# EAGLE design xplduino_v0_0_final_4 (EAGLE 5.10)
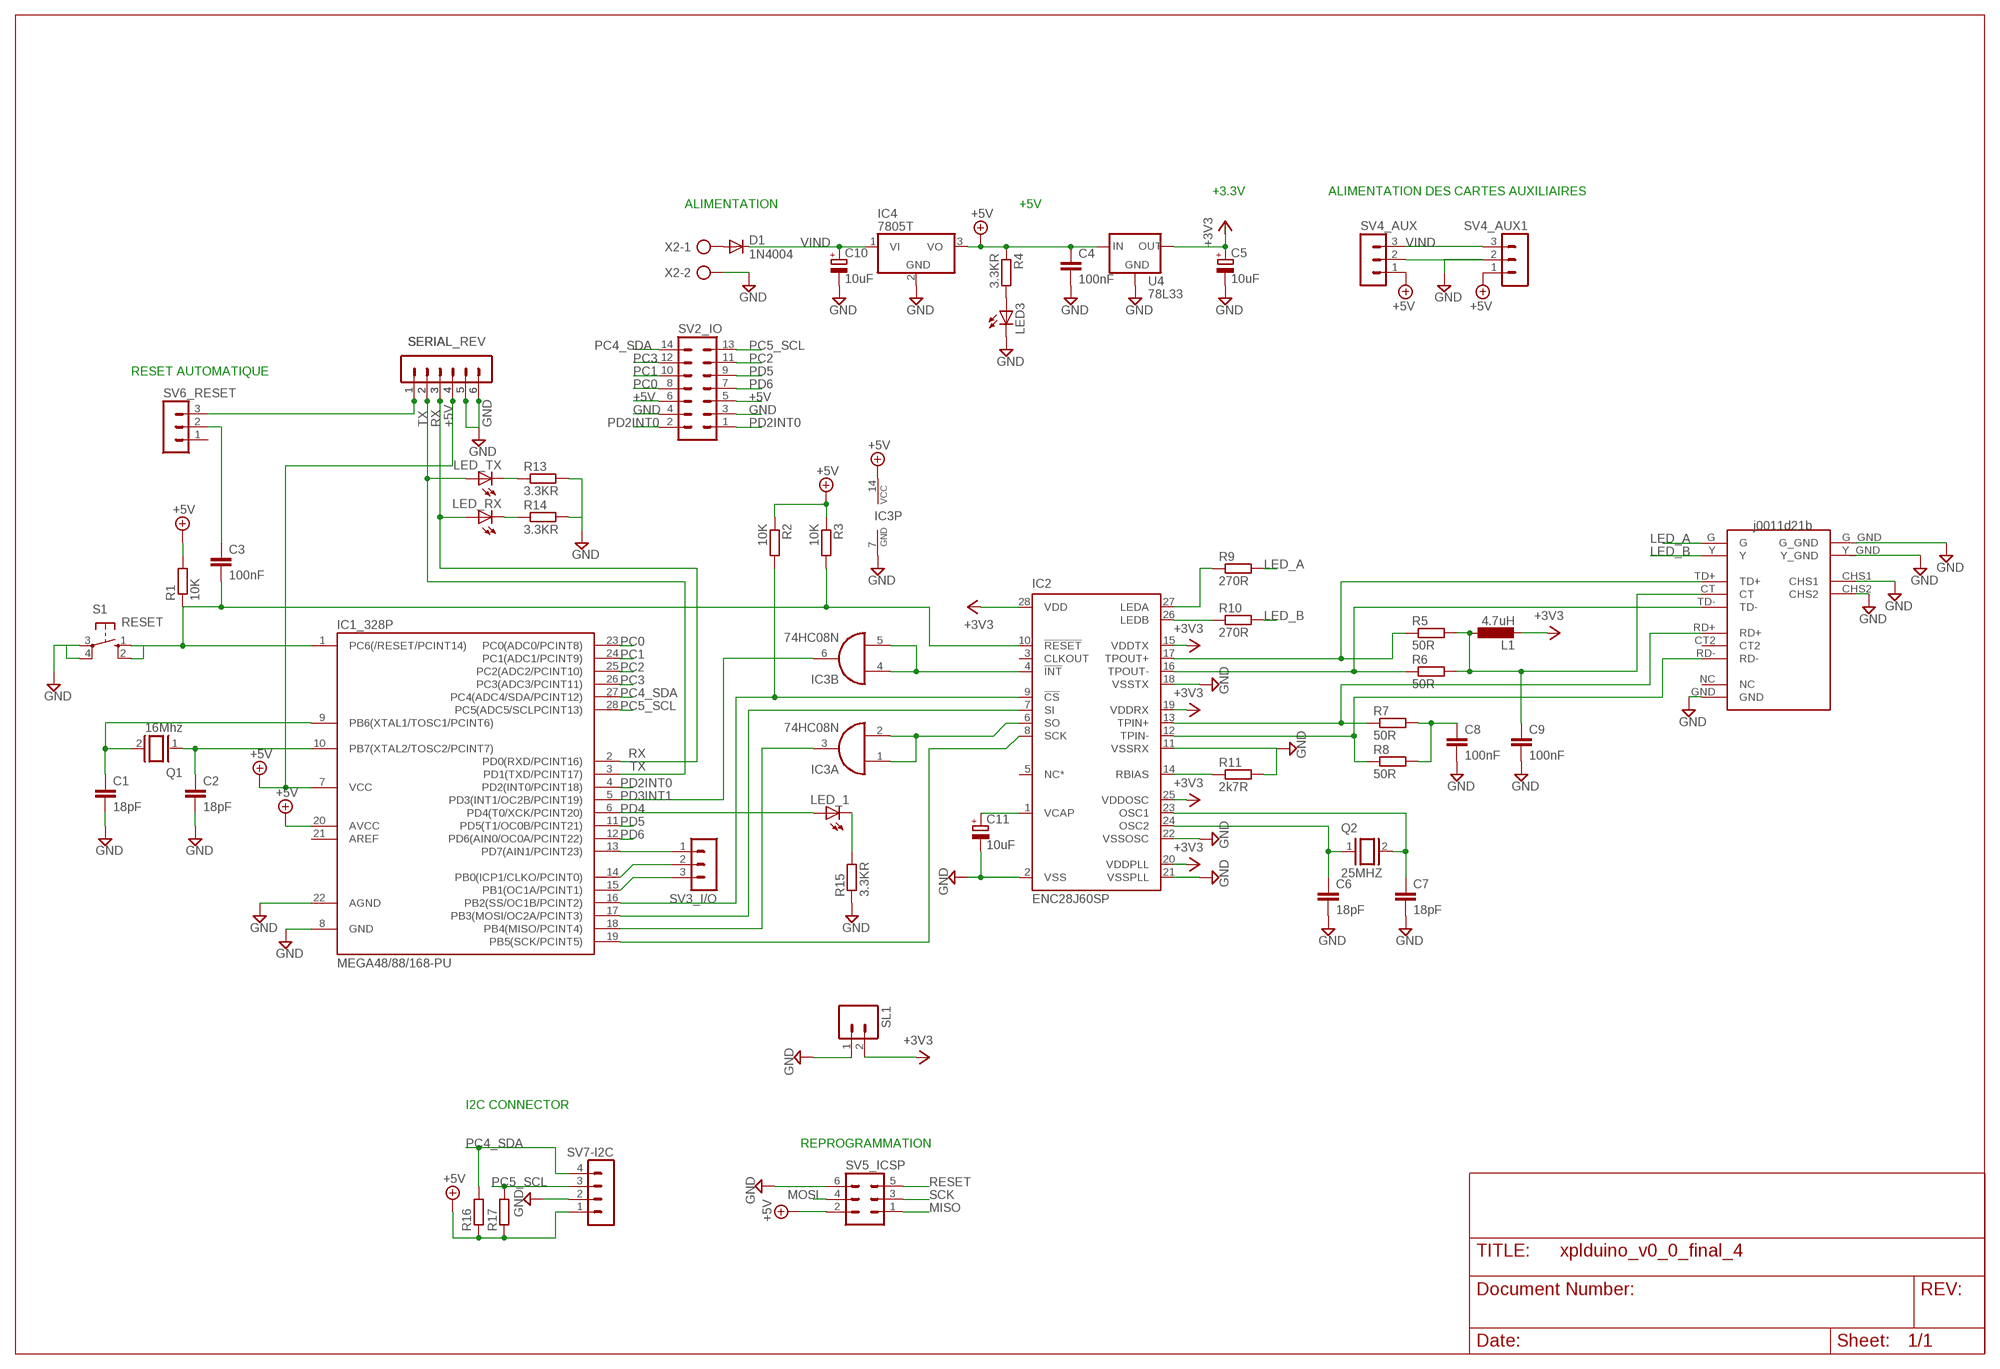
[diagram p0: schematic, sheet 1]

## Parts
C1  18pF  C-EU025-025X050  [C025-025X050]
C2  18pF  C-EU025-025X050  [C025-025X050]
C3  100nF  C-EU025-025X050  [C025-025X050]
C4  100nF  C-EU025-025X050  [C025-025X050]
C5  10uF  CPOL-EUE2-5  [E2-5]
C6  18pF  C-EU025-025X050  [C025-025X050]
C7  18pF  C-EU025-025X050  [C025-025X050]
C8  100nF  C-EU025-025X050  [C025-025X050]
C9  100nF  C-EU025-025X050  [C025-025X050]
C10  10uF  CPOL-EUE2-5  [E2-5]
C11  10uF  CPOL-EUE2-5  [E2-5]
D1  1N4004  DIODE-D-5  [D-5]
IC1_328P  MEGA48/88/168-PU  [DIL28-3]
IC2  ENC28J60SP  [DIL28-3]
IC3  74HC08N  [DIL14]
IC4  7805T  [TO220H]
L1  4.7uH  L-EU0207/7  [0207/7]
LED3  LED3MM  [LED3MM]
LED_1  LED3MM  [LED3MM]
LED_RX  LED3MM  [LED3MM]
LED_TX  LED3MM  [LED3MM]
Q1  16Mhz  XTAL/S  [QS]
Q2  25MHZ  XTAL/S  [QS]
R1  10K  R-EU_0207/7  [0207/7]
R2  10K  R-EU_0207/7  [0207/7]
R3  10K  R-EU_0207/7  [0207/7]
R4  3.3KR  R-EU_0207/7  [0207/7]
R5  50R  R-EU_0207/7  [0207/7]
R6  50R  R-EU_0207/7  [0207/7]
R7  50R  R-EU_0207/7  [0207/7]
R8  50R  R-EU_0207/7  [0207/7]
R9  270R  R-EU_0207/7  [0207/7]
R10  270R  R-EU_0207/7  [0207/7]
R11  2k7R  R-EU_0207/7  [0207/7]
R13  3.3KR  R-EU_0207/7  [0207/7]
R14  3.3KR  R-EU_0207/7  [0207/7]
R15  3.3KR  R-EU_0207/7  [0207/7]
R16  R-EU_0204/5  [0204/5]
R17  R-EU_0204/5  [0204/5]
S1  RESET  10-XX  [B3F-10XX]
SERIAL  MA06-1  [MA06-1]
SERIAL_REV  MA06-1  [MA06-1]
SL1  MA02  [02PA]
SV2_IO  MA07-2  [MA07-2]
SV3_I/O  MA03-1  [MA03-1]
SV4_AUX  MA03-1  [MA03-1]
SV4_AUX1  MA03-1  [MA03-1]
SV5_ICSP  MA03-2  [MA03-2]
SV6_RESET  MA03-1  [MA03-1]
SV7-I2C  MA04-1  [MA04-1]
U4  78L33  78LXX  [78LXX]
U$1  J0011D21B  [J0011D21B]
X2  AK500/2-H  [AK500/2-H]

## Nets
+3V3: C5.+ IC2.15(VDDTX) IC2.19(VDDRX) IC2.20(VDDPLL) IC2.25(VDDOSC) IC2.28(VDD) L1.2 SL1.2 U4.OUT
+5V: C4.1 IC1_328P.7(VCC) IC1_328P.20(AVCC) IC3.14(P:VCC) IC4.3(VO) R1.2 R2.1 R3.1 R4.1 R16.1 R17.1 SERIAL.4 SERIAL_REV.4 SV2_IO.5 SV2_IO.6 SV4_AUX1.1 SV4_AUX.1 SV5_ICSP.2 SV7-I2C.1 U4.IN
GND: C1.2 C2.2 C4.2 C5.- C6.2 C7.2 C8.2 C9.2 C10.- C11.- IC1_328P.8(GND) IC1_328P.22(AGND) IC2.2(VSS) IC2.11(VSSRX) IC2.18(VSSTX) IC2.21(VSSPLL) IC2.22(VSSOSC) IC3.7(P:GND) IC4.2(GND) LED3.K(C) R11.2 R13.2 R14.2 R15.1 S1.3(P) S1.4(P1) SERIAL.5 SERIAL.6 SERIAL_REV.5 SERIAL_REV.6 SL1.1 SV2_IO.3 SV2_IO.4 SV4_AUX1.2 SV4_AUX.2 SV5_ICSP.6 SV7-I2C.2 U4.GND U$1.CHS1 U$1.CHS2 U$1.G_GND U$1.GND U$1.Y_GND X2.2
LED_A: R9.2 U$1.G
LED_B: R10.2 U$1.Y
LEDA: IC2.27(LEDA) R9.1
LEDB: IC2.26(LEDB) R10.1
MISO: IC1_328P.18(PB4(MISO/PCINT4)) IC3.3(A:O) SV5_ICSP.1
MOSI: IC1_328P.17(PB3(MOSI/OC2A/PCINT3)) IC2.7(SI) SV5_ICSP.4
N$1: LED_TX.K(C) R13.1
N$2: LED_RX.K(C) R14.1
N$3: IC1_328P.14(PB0(ICP1/CLKO/PCINT0)) SV3_I/O.2
N$4: IC2.4(!INT) IC3.4(B:I0) IC3.5(B:I1)
N$6: IC1_328P.15(PB1(OC1A/PCINT1)) SV3_I/O.3
N$7: C2.1 IC1_328P.10(PB7(XTAL2/TOSC2/PCINT7)) Q1.1
N$8: C1.1 IC1_328P.9(PB6(XTAL1/TOSC1/PCINT6)) Q1.2
N$9: LED_1.K(C) R15.2
N$10: C3.1 SV6_RESET.2
N$11: IC2.6(SO) IC3.1(A:I0) IC3.2(A:I1)
N$12: IC1_328P.13(PD7(AIN1/PCINT23)) SV3_I/O.1
N$15: LED3.A R4.2
N$17: C11.+ IC2.1(VCAP)
N$18: IC2.14(RBIAS) R11.1
N$19: C6.1 IC2.24(OSC2) Q2.1
N$20: C7.1 IC2.23(OSC1) Q2.2
N$25: C8.1 R7.2 R8.2
N$26: C9.1 L1.1 R5.2 R6.2 U$1.CT
PC0: IC1_328P.23(PC0(ADC0/PCINT8)) SV2_IO.8
PC1: IC1_328P.24(PC1(ADC1/PCINT9)) SV2_IO.10
PC2: IC1_328P.25(PC2(ADC2/PCINT10)) SV2_IO.11
PC3: IC1_328P.26(PC3(ADC3/PCINT11)) SV2_IO.12
PC4_SDA: IC1_328P.27(PC4(ADC4/SDA/PCINT12)) R16.2 SV2_IO.14 SV7-I2C.4
PC5_SCL: IC1_328P.28(PC5(ADC5/SCLPCINT13)) R17.2 SV2_IO.13 SV7-I2C.3
PD2INT0: IC1_328P.4(PD2(INT0/PCINT18)) SV2_IO.1 SV2_IO.2
PD3INT1: IC1_328P.5(PD3(INT1/OC2B/PCINT19)) IC3.6(B:O)
PD4: IC1_328P.6(PD4(T0/XCK/PCINT20)) LED_1.A
PD5: IC1_328P.11(PD5(T1/OC0B/PCINT21)) SV2_IO.9
PD6: IC1_328P.12(PD6(AIN0/OC0A/PCINT22)) SV2_IO.7
RESET: C3.2 IC1_328P.1(PC6(/RESET/PCINT14)) IC2.10(!RESET) R1.1 R3.2 S1.1(S) S1.2(S1) SV5_ICSP.5
RTS: SERIAL.1 SERIAL_REV.1 SV6_RESET.3
RX: IC1_328P.2(PD0(RXD/PCINT16)) LED_RX.A SERIAL.3 SERIAL_REV.3
SCK: IC1_328P.19(PB5(SCK/PCINT5)) IC2.8(SCK) SV5_ICSP.3
SS: IC1_328P.16(PB2(SS/OC1B/PCINT2)) IC2.9(!CS) R2.2
TPIN+: IC2.13(TPIN+) R7.1 U$1.RD+
TPIN-: IC2.12(TPIN-) R8.1 U$1.RD-
TPOUT+: IC2.17(TPOUT+) R5.1 U$1.TD+
TPOUT-: IC2.16(TPOUT-) R6.1 U$1.TD-
TX: IC1_328P.3(PD1(TXD/PCINT17)) LED_TX.A SERIAL.2 SERIAL_REV.2
VIN: D1.A X2.1
VIND: C10.+ D1.C IC4.1(VI) SV4_AUX1.3 SV4_AUX.3
Unconnected: IC1_328P.21(AREF) IC2.3(CLKOUT) IC2.5(NC*) IC3.8(C:O) IC3.9(C:I0) IC3.10(C:I1) IC3.11(D:O) IC3.12(D:I0) IC3.13(D:I1) SV6_RESET.1 U$1.CT2 U$1.NC

## Notes on the sheet
- +3.3V | ALIMENTATION DES CARTES AUXILIAIRES
- ALIMENTATION | +5V
- RESET AUTOMATIQUE
- I2C CONNECTOR
- REPROGRAMMATION

## Library data of the parts
C1-C4 C6-C9 = resistor:C-EU: CAPACITOR, European symbol
C5 C10 C11 = rcl:CPOL-EU: POLARIZED CAPACITOR, European symbol
D1 = diode:DIODE-: DIODE
IC1_328P = avr-7:MEGA48/88/168-PU
IC2 = microchip:ENC28J60: Stand-Alone Ethernet Controller with SPI Interface Source: http://ww1.microchip.com/downloads/en/DeviceDoc/39662c.pdf
IC3 = 74xx-eu:74*08: Quad 2-input AND gate
IC4 = linear:78*: Positive VOLTAGE REGULATOR Source: http://cache.national.com/ds/LM/LM78L05.pdf http://www.fairchildsemi.com/ds/LM/LM7805.pdf
L1 = rcl:L-EU: INDUCTOR, European symbol
LED3 LED_1 LED_RX LED_TX = led:LED: LED OSRAM: - CHIPLED LG R971, LG N971, LY N971, LG Q971, LY Q971, LO R971, LY R971 LH N974, LH R974 LS Q976, LO Q976, LY Q976 LO Q996 - Hyper CHIPLED LW Q18S LB Q993, LB Q99A, LB R99A - SideLED LS A670, LO A670, LY A670, LG A670, LP A670 LB A673, LV A673, LT A673, LW A673 LH A674 LY A675 LS A676, LA A676, LO A676, LY A676, LW A676 LS A679, LY A679, LG A679 - Hyper Micro SIDELED® LS Y876, LA Y876, LO Y876, LY Y876 LT Y87S - SmartLED LW L88C, LW L88S LB L89C, LB L89S, LG L890 LS L89K, LO L89K, LY L89K LS L896, LA L896, LO L896, LY L896 - TOPLED LS T670, LO T670, LY T670, LG T670, LP T670 LSG T670, LSP T670, LSY T670, LOP T670, LYG T670 LG T671, LOG T671, LSG T671 LB T673, LV T673, LT T673, LW T673 LH T674 LS T676, LA T676, LO T676, LY T676, LB T676, LH T676, LSB T676, LW T676 LB T67C, LV T67C, LT T67C, LS T67K, LO T67K, LY T67K, LW E67C LS E67B, LA E67B, LO E67B, LY E67B, LB E67C, LV E67C, LT E67C LW T67C LS T679, LY T679, LG T679 LS T770, LO T770, LY T770, LG T770, LP T770 LB T773, LV T773, LT T773, LW T773 LH T774 LS E675, LA E675, LY E675, LS T675 LS T776, LA T776, LO T776, LY T776, LB T776 LHGB T686 LT T68C, LB T68C - Hyper Mini TOPLED® LB M676 - Mini TOPLED Santana® LG M470 LS M47K, LO M47K, LY M47K Source: http://www.osram.convergy.de LUXEON: - LUMILED® LXK2-PW12-R00, LXK2-PW12-S00, LXK2-PW14-U00, LXK2-PW14-V00 LXK2-PM12-R00, LXK2-PM12-S00, LXK2-PM14-U00 LXK2-PE12-Q00, LXK2-PE12-R00, LXK2-PE12-S00, LXK2-PE14-T00, LXK2-PE14-U00 LXK2-PB12-K00, LXK2-PB12-L00, LXK2-PB12-M00, LXK2-PB14-N00, LXK2-PB14-P00, LXK2-PB14-Q00 LXK2-PR12-L00, LXK2-PR12-M00, LXK2-PR14-Q00, LXK2-PR14-R00 LXK2-PD12-Q00, LXK2-PD12-R00, LXK2-PD12-S00 LXK2-PH12-R00, LXK2-PH12-S00 LXK2-PL12-P00, LXK2-PL12-Q00, LXK2-PL12-R00 Source: www.luxeon.com KINGBRIGHT: KA-3528ASYC Source: www.kingbright.com
Q1 Q2 = special:XTAL/S: CRYSTAL
R1-R11 R13-R17 = resistor:R-EU_: RESISTOR, European symbol
S1 = switch-omron:10-XX: OMRON SWITCH
SERIAL SERIAL_REV = con-lstb:MA06-1: PIN HEADER
SL1 = con-amp-quick:MA02: AMP QUICK CONNECTOR; OC_FARNELL: unknown; OC_NEWARK: unknown
SV2_IO = con-lstb:MA07-2: PIN HEADER
SV3_I/O SV4_AUX SV4_AUX1 SV6_RESET = con-lstb:MA03-1: PIN HEADER; OC_FARNELL: unknown; OC_NEWARK: unknown
SV5_ICSP = con-lstb:MA03-2: PIN HEADER; OC_FARNELL: unknown; OC_NEWARK: unknown
SV7-I2C = con-lstb:MA04-1: PIN HEADER; OC_FARNELL: unknown; OC_NEWARK: unknown
U4 = v-reg:78LXX: VOLTAGE REGULATOR
U$1 = con-j0011d21b:J0011D21B
X2 = con-ptr500:AK500/2-H: CONNECTOR Aug. 2004 / PTR Meßtechnik: Die Bezeichnung der Serie AK505 wurde geändert. Es handelt sich hierbei um AK500 in horizontaler Ausführung.

## Board
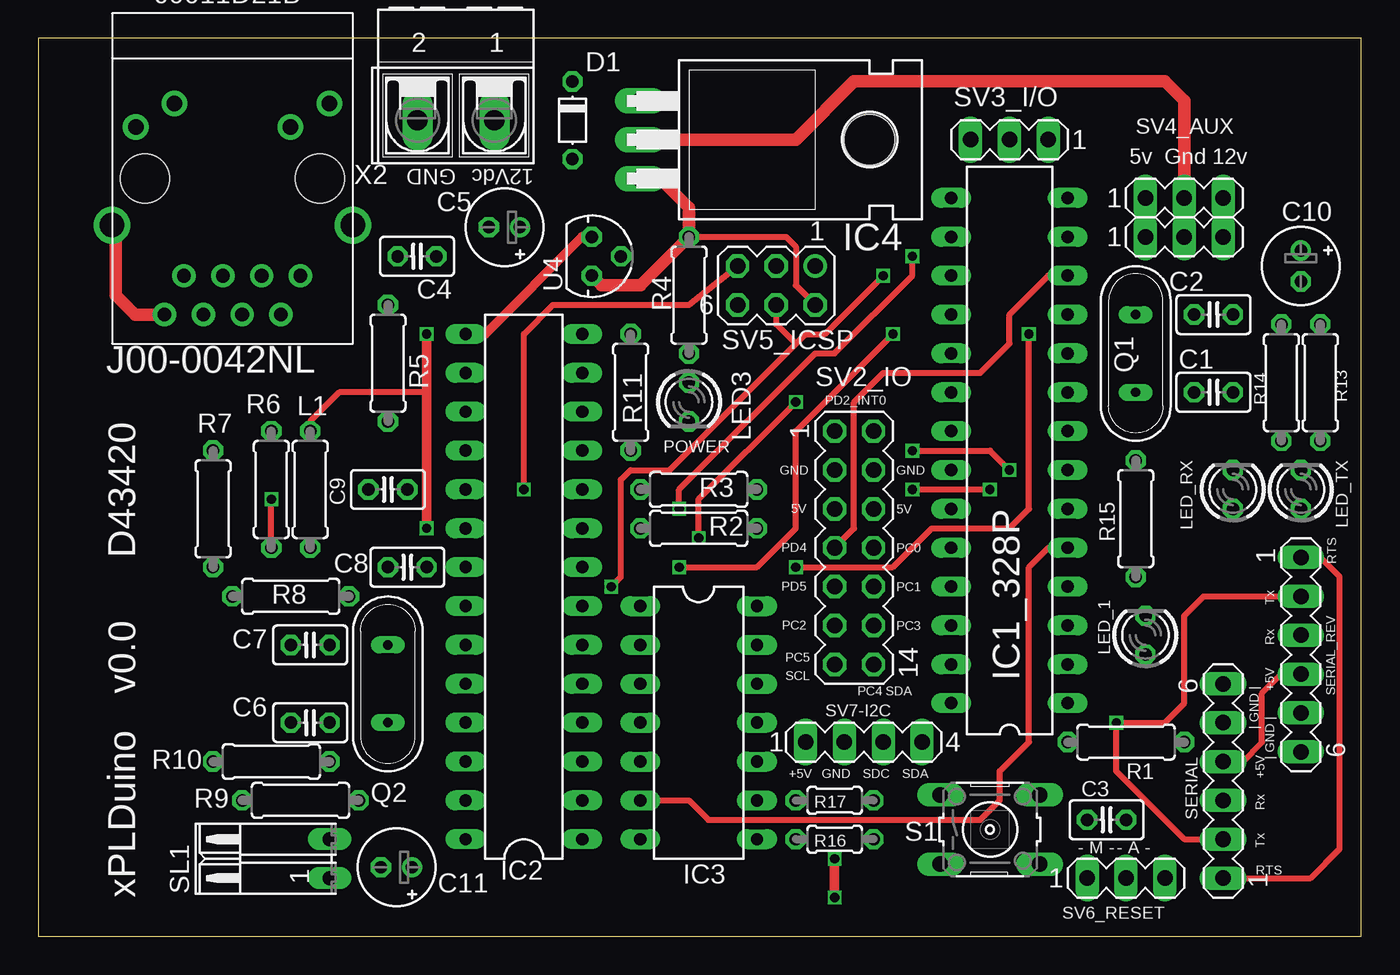
[diagram p1: board, top side]
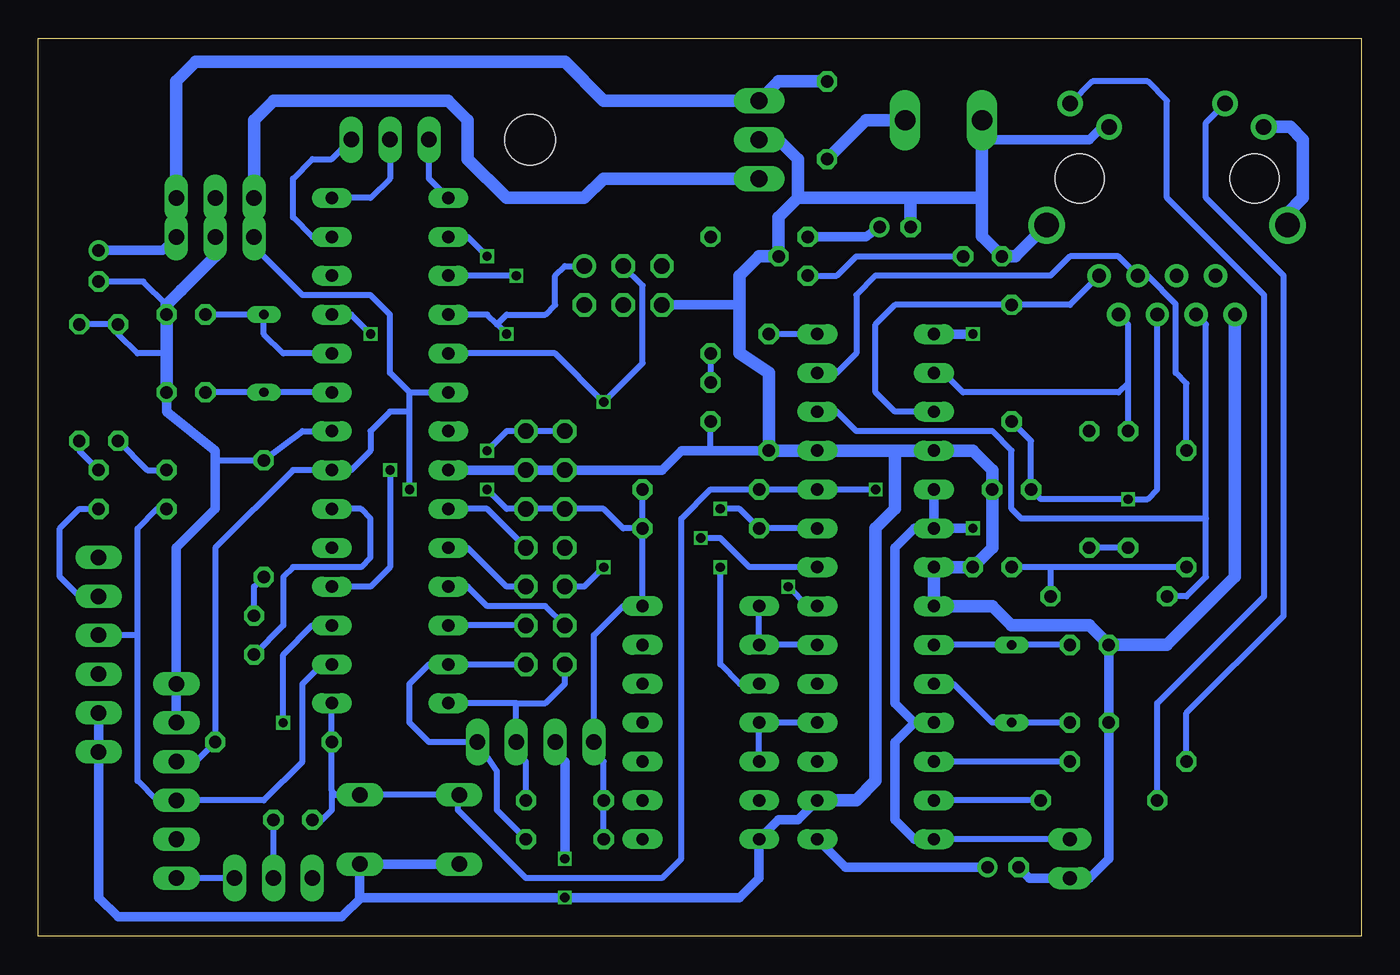
[diagram p2: board, bottom side, seen from below]

Size 86.5 x 58.7 mm. Coordinates in mm from the lower left corner, seen from the top.
Outline: 0,0 86.5,0 86.5,58.7 0,58.7 0,0
Copper layers (1*16): Top 0.035mm / dielectric 1.5mm / Bottom 0.035mm
Design rules "Fusion_eagle_rule_v1.1": minimum track width 6mil, minimum drill 12mil, track to track 6mil, track to pad 6mil, pad to pad 6mil, via to via 6mil, smd to smd 0mil, copper to edge 10mil, drill to drill 10mil, minimum pad ring 10mil, minimum via ring 6mil, stop-mask expansion 2mil, vias tented up to drill 100mil, thermal gap 10mil

### Footprints (pad centres in the part's own frame; a part is rotated, then mirrored left to right if it is on the bottom)
C025-025X050 = drill 0.813 octagon: 1 -1.27,0; 2 1.27,0
E2-5 = drill 0.813 pad 1.27 round: + -1.016,0 | drill 0.813 pad 1.27 octagon: - 1.016,0
D-5 = drill 0.813 octagon: A 2.54,0; C -2.54,0
DIL28-3 = drill 0.813 long: 1 -16.51,-3.81; 2 -13.97,-3.81; 3 -11.43,-3.81; 4 -8.89,-3.81; 5 -6.35,-3.81; 6 -3.81,-3.81; 7 -1.27,-3.81; 8 1.27,-3.81; 9 3.81,-3.81; 10 6.35,-3.81; 11 8.89,-3.81; 12 11.43,-3.81; 13 13.97,-3.81; 14 16.51,-3.81; 15 16.51,3.81; 16 13.97,3.81; 17 11.43,3.81; 18 8.89,3.81; 19 6.35,3.81; 20 3.81,3.81; 21 1.27,3.81; 22 -1.27,3.81; 23 -3.81,3.81; 24 -6.35,3.81; 25 -8.89,3.81; 26 -11.43,3.81; 27 -13.97,3.81; 28 -16.51,3.81
DIL14 = drill 0.813 long: 1 -7.62,-3.81; 2 -5.08,-3.81; 3 -2.54,-3.81; 4 0,-3.81; 5 2.54,-3.81; 6 5.08,-3.81; 7 7.62,-3.81; 8 7.62,3.81; 9 5.08,3.81; 10 2.54,3.81; 11 0,3.81; 12 -2.54,3.81; 13 -5.08,3.81; 14 -7.62,3.81
TO220H = drill 1.118 long: 1 -2.54,-10.16; 2 0,-10.16; 3 2.54,-10.16 | hole 3.302: 0,4.826
0207/7 = drill 0.813 octagon: 1 -3.81,0; 2 3.81,0
LED3MM = drill 0.813 octagon: A -1.27,0; K 1.27,0
QS = drill 0.61 long: 1 -2.54,0; 2 2.54,0
0204/5 = drill 0.813 octagon: 1 -2.54,0; 2 2.54,0
B3F-10XX = drill 1.016 long: 1 -3.251,2.261; 2 3.251,2.261; 3 -3.251,-2.261; 4 3.251,-2.261
MA06-1 = drill 1.016 long: 1 -6.35,0; 2 -3.81,0; 3 -1.27,0; 4 1.27,0; 5 3.81,0; 6 6.35,0
02PA = drill 0.914 long: 1 -1.27,0; 2 1.27,0
MA07-2 = drill 1.016 octagon: 1 -7.62,-1.27; 2 -7.62,1.27; 3 -5.08,-1.27; 4 -5.08,1.27; 5 -2.54,-1.27; 6 -2.54,1.27; 7 0,-1.27; 8 0,1.27; 9 2.54,-1.27; 10 2.54,1.27; 11 5.08,-1.27; 12 5.08,1.27; 13 7.62,-1.27; 14 7.62,1.27
MA03-1 = drill 1.016 long: 1 -2.54,0; 2 0,0; 3 2.54,0
MA03-2 = drill 1.016 round: 1 -2.54,-1.27 | drill 1.016 octagon: 2 -2.54,1.27; 3 0,-1.27; 4 0,1.27; 5 2.54,-1.27; 6 2.54,1.27
MA04-1 = drill 1.016 long: 1 -3.81,0; 2 -1.27,0; 3 1.27,0; 4 3.81,0
78LXX = drill 0.813 octagon: GND 0,1.905; IN 1.27,0; OUT -1.27,0
J0011D21B = drill 1.6 round: CHS1 7.874,-3.048; CHS2 -7.874,-3.048 | drill 0.889 pad 1.524 round: CT 0.635,-8.89; CT2 -0.635,-6.35; GND -4.445,-8.89; NC -3.175,-6.35; RD+ 1.905,-6.35; RD- -1.905,-8.89; TD+ 4.445,-6.35; TD- 3.175,-8.89 | drill 1.016 pad 1.676 round: G 6.325,4.902; G_GND 3.785,3.378; Y -3.785,4.902; Y_GND -6.325,3.378 | hole 3.2: -5.715,0; 5.715,0
AK500/2-H = drill 1.321 long: 1 -2.515,0; 2 2.515,0

### Placement (x,y rotation side)
C1  76.83,35.56 0 top
C2  76.83,40.64 0 top
C3  69.85,7.62 180 top
C4  24.77,44.45 180 top
C5  30.48,46.35 180 top
C6  17.78,13.97 180 top
C7  17.78,19.05 180 top
C8  24.13,24.13 0 top
C9  22.86,29.21 0 top
C10  82.55,43.81 270 top
C11  23.42,4.52 180 top
D1  34.92,53.34 270 top
IC1_328P  63.5,31.75 90 top
IC2  31.75,22.86 90 top
IC3  43.18,13.97 270 top
IC4  49.53,52.07 270 top
L1  17.78,29.21 90 top
LED3  42.55,34.92 270 top
LED_1  72.39,19.68 90 top
LED_RX  78.11,29.21 90 top
LED_TX  82.55,29.21 90 top
Q1  71.75,38.1 270 top
Q2  22.86,16.51 90 top
R1  71.12,12.7 0 top
R2  43.18,26.67 180 top
R3  43.18,29.21 180 top
R4  42.55,41.91 270 top
R5  22.86,37.47 270 top
R6  15.24,29.21 270 top
R7  11.43,27.94 270 top
R8  16.51,22.23 0 top
R9  17.14,8.89 180 top
R10  15.24,11.43 180 top
R11  38.73,35.56 270 top
R13  83.82,36.2 90 top
R14  81.28,36.2 90 top
R15  71.75,27.3 270 top
R16  52.07,6.35 0 top
R17  52.07,8.89 0 top
S1  62.23,6.99 0 top
SERIAL  77.47,10.16 90 top
SERIAL_REV  82.55,18.41 270 top
SL1  19.05,5.08 90 top
SV2_IO  53.34,25.4 270 top
SV3_I/O  63.5,52.07 180 top
SV4_AUX  74.93,45.72 0 top
SV4_AUX1  74.93,48.26 0 top
SV5_ICSP  48.26,42.55 180 top
SV6_RESET  71.12,3.81 0 top
SV7-I2C  53.98,12.7 0 top
U4  36.2,44.45 270 top
U$1  12.7,49.53 0 top
X2  27.3,53.34 180 top

### Tracks (layer width: path | path; a pad name or v marks a point on that pad's centre or on a via)
+3V3  (via drill 0.6)
  Top 0.406: L1.2 17.78,33.66 19.68,35.56 25.4,35.56
  Top 0.61: v25.4,26.67 25.4,35.56 v25.4,39.37 | IC2.15 29.21,39.37 35.56,45.72 U4.OUT
  Bottom 0.406: SL1.2 IC2.28
  Bottom 0.61: IC2.20 IC2.19 | IC2.20 29.21,26.67 30.48,25.4 30.48,15.24 29.21,13.97 | 29.21,13.97 IC2.25 | 29.21,13.97 30.48,12.7 30.48,7.62 29.21,6.35 IC2.28 | v25.4,39.37 IC2.15 | C5.+ 32.38,45.72 U4.OUT | IC2.20 v25.4,26.67
+5V  (via drill 0.6)
  Top 0.406: v57.15,29.21 v62.23,29.21 | SV5_ICSP.2 49.53,42.55 49.53,45.09 48.9,45.72 R4.1 | SERIAL.4 78.74,11.43 80.01,12.7 80.01,15.88 81.28,17.14 SERIAL_REV.4
  Top 0.813: U4.IN 36.83,42.55 39.37,42.55 R4.1 42.55,47.62 40.64,49.53 IC4.3
  Bottom 0.406: R2.1 IC3.14 48.26,21.59 50.16,19.68 SV7-I2C.1 50.16,12.06 49.53,11.43 R17.1 R16.1 | R2.1 R3.1 | 62.23,35.56 IC1_328P.20 | 62.23,35.56 63.5,36.83 63.5,40.64 64.77,41.91 69.22,41.91 72.39,45.09 SV4_AUX.1 | SERIAL.4 76.2,11.43 R1.2 74.93,25.4 69.85,30.48 IC1_328P.7 66.04,30.48 64.77,31.75 64.77,33.02 63.5,34.29 62.23,34.29 | R2.1 48.26,26.67 49.53,27.94 SV2_IO.5 SV2_IO.6 55.88,27.94 v57.15,29.21 | C4.1 33.02,44.45 34.29,43.18 U4.IN | v62.23,29.21 62.23,34.29 | 62.23,34.29 62.23,35.56
  Bottom 0.813: IC4.3 49.53,49.53 50.8,48.26 55.88,48.26 58.42,50.8 58.42,53.34 59.69,54.61 71.12,54.61 72.39,53.34 SV4_AUX1.1 SV4_AUX.1
GND  (via drill 0.6)
  Top 0.61: v52.07,2.54 v52.07,5.08
  Top 0.813: IC4.2 49.53,52.07 53.34,55.88 73.66,55.88 74.93,54.61 SV4_AUX1.2 | U$1.GND 6.35,40.64 5.08,41.91 5.08,46.23 U$1.CHS2
  Bottom 0.406: IC1_328P.8 69.22,33.02 R15.1 74.93,31.11 | R13.2 R14.2 81.28,39.37 80.01,38.1 78.11,38.1 | 77.15,42.23 77.22,42.16 | 42.55,31.75 LED3.K | C10.- 79.63,42.8 78.11,41.27
  Bottom 0.61: C7.2 C6.2 16.51,5.08 17.78,3.81 SL1.1 21.69,3.81 C11.- | IC1_328P.22 SV2_IO.4 SV2_IO.3 45.72,30.48 44.45,31.75 42.55,31.75 R11.2 | v52.07,5.08 52.07,11.43 52.7,12.06 SV7-I2C.2 | U$1.G_GND 16.94,52.91 17.78,52.07 24.79,52.07 | IC2.2 36.83,7.62 38.1,7.62 IC3.7 39.37,3.81 40.64,2.54 v52.07,2.54 65.41,2.54 | SERIAL_REV.6 SERIAL_REV.5 82.55,2.54 81.28,1.27 66.67,1.27 65.41,2.54 | C1.2 78.11,34.29 74.93,31.75 74.93,31.11 74.93,27.94 77.47,25.4 SERIAL.6 SERIAL.5 | S1.3 S1.4 65.48,2.62 65.41,2.54 | 40.64,41.27 SV5_ICSP.6
  Bottom 0.813: C1.2 78.11,38.1 C2.2 78.11,41.27 77.15,42.23 74.93,44.45 SV4_AUX.2 SV4_AUX1.2 | 30.48,31.75 IC2.18 25.4,31.75 24.13,30.48 C9.2 24.13,25.4 C8.2 IC2.21 IC2.22 24.13,21.59 22.86,20.32 17.78,20.32 C7.2 12.7,19.05 8.26,23.5 U$1.GND | 30.48,31.75 IC2.11 R11.2 38.73,36.83 40.64,38.1 40.64,41.27 40.64,43.18 39.37,44.45 U4.GND 38.1,46.99 36.83,48.26 | IC2.2 33.02,8.89 31.75,10.16 31.75,26.67 30.48,27.94 30.48,31.75 | U$1.CHS1 22.61,44.45 C4.2 24.79,45.74 24.79,48.26 | 24.79,48.26 24.79,52.07 X2.2 | 29.46,48.26 C5.- | 36.83,48.26 36.83,50.8 38.1,52.07 IC4.2 | 36.83,48.26 29.46,48.26 | 29.46,48.26 24.79,48.26 | U$1.CHS2 4.83,47.24 3.81,48.26 3.81,52.07 4.65,52.91 U$1.Y_GND
LED_A
  Bottom 0.406: U$1.G 17.58,55.88 13.97,55.88 12.7,54.61 12.7,48.26 6.35,41.91 6.35,22.23 13.34,15.24 R9.2
LED_B
  Bottom 0.406: U$1.Y 10.16,53.19 10.16,48.26 5.08,43.18 5.08,20.95 11.43,14.61 R10.2
LEDA
  Bottom 0.406: R9.1 IC2.27
LEDB
  Bottom 0.406: R10.1 IC2.26
MISO  (via drill 0.6)
  Top 0.406: v41.91,24.13 46.99,24.13 49.53,26.67 49.53,33.02 v55.88,39.37
  Bottom 0.406: IC3.3 40.64,16.51 41.91,17.78 v41.91,24.13 | v55.88,39.37 56.52,40.01 | 56.52,40.01 57.15,40.64 IC1_328P.18 | SV5_ICSP.1 52.07,43.81 52.7,43.18 52.7,41.27 53.34,40.64 55.88,40.64 56.52,40.01
MOSI  (via drill 0.6)
  Top 0.406: v37.47,22.86 38.1,23.5 38.1,29.84 38.73,30.48 41.27,30.48 49.53,38.73 | 49.53,38.73 50.16,39.37 51.44,39.37 v55.24,43.18 | SV5_ICSP.4 48.26,40.01 49.53,38.73
  Bottom 0.406: IC2.7 36.2,21.59 v37.47,22.86 | v55.24,43.18 IC1_328P.17
N$1
  Bottom 0.406: LED_TX.K 83.82,31.75 R13.1
N$2
  Bottom 0.406: R14.1 79.38,30.48 LED_RX.K
N$3
  Bottom 0.406: SV3_I/O.2 63.5,49.53 64.77,48.26 IC1_328P.14
N$4
  Bottom 0.406: IC2.4 IC3.4 IC3.5
N$6
  Bottom 0.406: IC1_328P.15 60.96,49.53 SV3_I/O.3
N$7
  Bottom 0.406: IC1_328P.10 70.48,38.1 71.75,39.37 Q1.1 C2.1
N$8
  Bottom 0.406: C1.1 Q1.2 IC1_328P.9
N$9
  Bottom 0.406: LED_1.K 72.39,22.86 R15.2
N$10
  Bottom 0.406: SV6_RESET.2 C3.1
N$11
  Bottom 0.406: IC2.6 IC3.2 IC3.1
N$12
  Bottom 0.406: SV3_I/O.1 67.31,50.8 68.58,50.8 69.85,49.53 69.85,46.99 68.58,45.72 IC1_328P.13
N$15
  Bottom 0.406: R4.2 LED3.A
N$17
  Bottom 0.61: C11.+ 33.73,4.52 IC2.1
N$18
  Bottom 0.406: IC2.14 R11.1
N$19
  Bottom 0.406: IC2.24 26.67,16.51 24.13,13.97 Q2.1 C6.1
N$20
  Bottom 0.406: IC2.23 Q2.2 C7.1
N$25
  Bottom 0.406: R7.2 20.32,24.13 | 20.32,24.13 C8.1 | 20.32,24.13 R8.2
N$26  (via drill 0.6)
  Top 0.406: R6.2 v15.24,28.57
  Bottom 0.406: U$1.CT 13.34,29.21 13.97,28.57 v15.24,28.57 20.95,28.57 C9.1 21.59,32.38 R5.2 | R6.2 L1.1
PC0
  Bottom 0.406: IC1_328P.23 57.15,27.94 SV2_IO.8
PC1
  Bottom 0.406: IC1_328P.24 58.42,25.4 55.88,22.86 SV2_IO.10
PC2
  Bottom 0.406: IC1_328P.25 58.42,22.86 57.15,21.59 53.34,21.59 SV2_IO.11
PC3
  Bottom 0.406: SV2_IO.12 IC1_328P.26
PC4_SDA
  Bottom 0.406: SV2_IO.14 IC1_328P.27 60.96,17.78 62.23,16.51 62.23,13.97 60.96,12.7 SV7-I2C.4 56.52,10.79 56.52,8.26 R16.2
PC5_SCL
  Bottom 0.406: 55.24,15.24 53.34,15.24 52.07,16.51 SV2_IO.13 | 55.24,15.24 IC1_328P.28 | 55.24,15.24 SV7-I2C.3 55.24,12.06 54.61,11.43 R17.2
PD2INT0  (via drill 0.6)
  Top 0.406: v57.15,31.75 62.23,31.75 v63.5,30.48
  Bottom 0.406: IC1_328P.4 64.77,22.86 63.5,24.13 v63.5,30.48 | SV2_IO.1 SV2_IO.2 55.88,33.02 v57.15,31.75
PD3INT1
  Top 0.406: IC1_328P.5 66.04,25.4 64.77,24.13 64.77,12.7 62.87,10.79 62.87,8.89 61.59,7.62 43.81,7.62 42.55,8.89 IC3.6
PD4
  Bottom 0.406: IC1_328P.6 65.41,27.94 64.77,27.3 64.77,24.77 65.41,24.13 69.85,24.13 70.48,23.5 70.48,20.32 LED_1.A
PD5  (via drill 0.6)
  Top 0.406: v64.77,39.37 64.77,27.94 63.5,26.67 58.42,26.67 55.88,24.13 v49.53,24.13
  Bottom 0.406: v64.77,39.37 66.04,40.64 IC1_328P.11 | v49.53,24.13 50.8,22.86 SV2_IO.9
PD6
  Top 0.406: SV2_IO.7 53.34,26.67 53.34,34.92 55.24,36.83 61.59,36.83 63.5,38.73 63.5,40.64 66.04,43.18 IC1_328P.12
RESET  (via drill 0.6)
  Top 0.406: v31.75,29.21 31.75,39.37 33.66,41.27 42.55,41.27 SV5_ICSP.5
  Bottom 0.406: IC1_328P.1 R1.1 67.31,9.53 | v31.75,29.21 IC2.10 R3.2 42.55,29.21 44.45,27.3 44.45,5.08 45.72,3.81 54.61,3.81 59.05,8.26 59.05,9.17 S1.1 S1.2 67.03,9.25 67.31,9.53 | C3.2 67.94,7.62 67.31,8.26 67.31,9.53
RTS
  Top 0.406: SERIAL_REV.1 83.82,24.77 85.09,23.5 85.09,5.71 83.19,3.81 SERIAL.1
  Bottom 0.406: SV6_RESET.3 SERIAL.1
RX
  Bottom 0.406: IC1_328P.2 67.94,17.78 69.22,16.51 69.22,11.43 71.75,8.89 SERIAL.3 78.74,8.89 80.01,10.16 80.01,19.68 | LED_RX.A 78.74,27.94 80.01,26.67 80.01,19.68 | 80.01,19.68 SERIAL_REV.3
SCK  (via drill 0.6)
  Top 0.406: v43.18,26.04 43.18,28.57 v49.53,34.92
  Bottom 0.406: IC2.8 40.01,24.13 41.91,26.04 v43.18,26.04 | IC1_328P.19 52.7,38.1 v49.53,34.92 46.99,37.47 46.99,42.55 SV5_ICSP.3
SS  (via drill 0.6)
  Top 0.406: v41.91,27.94 41.91,29.21 50.8,38.1 52.07,38.1 57.15,43.18 v57.15,44.45
  Bottom 0.406: IC2.9 R2.2 40.64,27.94 v41.91,27.94 | v57.15,44.45 58.42,45.72 IC1_328P.16
TPIN+
  Bottom 0.406: IC2.13 34.29,36.83 33.02,38.1 33.02,41.91 31.75,43.18 20.32,43.18 19.05,44.45 15.88,44.45 U$1.RD+ 13.97,43.18 12.14,41.33 12.14,36.83 11.43,36.12 R7.1
TPIN-
  Bottom 0.406: IC2.12 34.29,34.29 33.02,33.02 24.13,33.02 22.86,31.75 22.86,27.94 22.23,27.3 10.16,27.3 | U$1.RD- 10.16,40.01 10.16,27.3 | R8.1 11.43,22.23 10.16,23.5 10.16,27.3
TPOUT+
  Bottom 0.406: IC2.17 30.48,34.29 31.75,35.56 31.75,40.01 30.48,41.27 R5.1 19.05,41.27 U$1.TD+
TPOUT-
  Bottom 0.406: U$1.TD- 15.24,40.01 R6.1 15.24,36.2 15.88,35.56 26.04,35.56 27.3,36.83 IC2.16
TX  (via drill 0.6)
  Top 0.406: SERIAL.2 74.93,6.35 70.48,10.79 v70.48,13.97 73.66,13.97 74.93,15.24 74.93,20.95 76.2,22.23 SERIAL_REV.2
  Bottom 0.406: IC1_328P.3 68.58,20.32 70.48,18.41 v70.48,13.97 | LED_TX.A 83.82,27.94 85.09,26.67 85.09,23.5 83.82,22.23 SERIAL_REV.2
VIN
  Bottom 0.813: X2.1 32.38,53.34 D1.A
VIND
  Bottom 0.61: C10.+ 78.36,44.83 SV4_AUX.3
  Bottom 0.813: D1.C 38.1,55.88 IC4.1 49.53,54.61 52.07,57.15 76.2,57.15 77.47,55.88 SV4_AUX1.3 SV4_AUX.3 77.47,46.99

### Text on the board
tNames: GND | 12Vdc | 5v Gnd 12v | J00-0042NL | PD2_INT0 | POWER | GND | GND | 5V | 5V | PD4 | D43420 | PC0 | RTS | PD5 | PC1 | Tx | PC2 | PC3 | Rx | PC5 | +5V | SCL | v0.0 | PC4 SDA | | GND | | | GND | | +5V | +5V | GND | SDC | SDA | Rx | Tx | - M - | - A - | RTS | xPLDuino